# Altium project ESP32WROVER-ARDUPILOT.PrjPcb
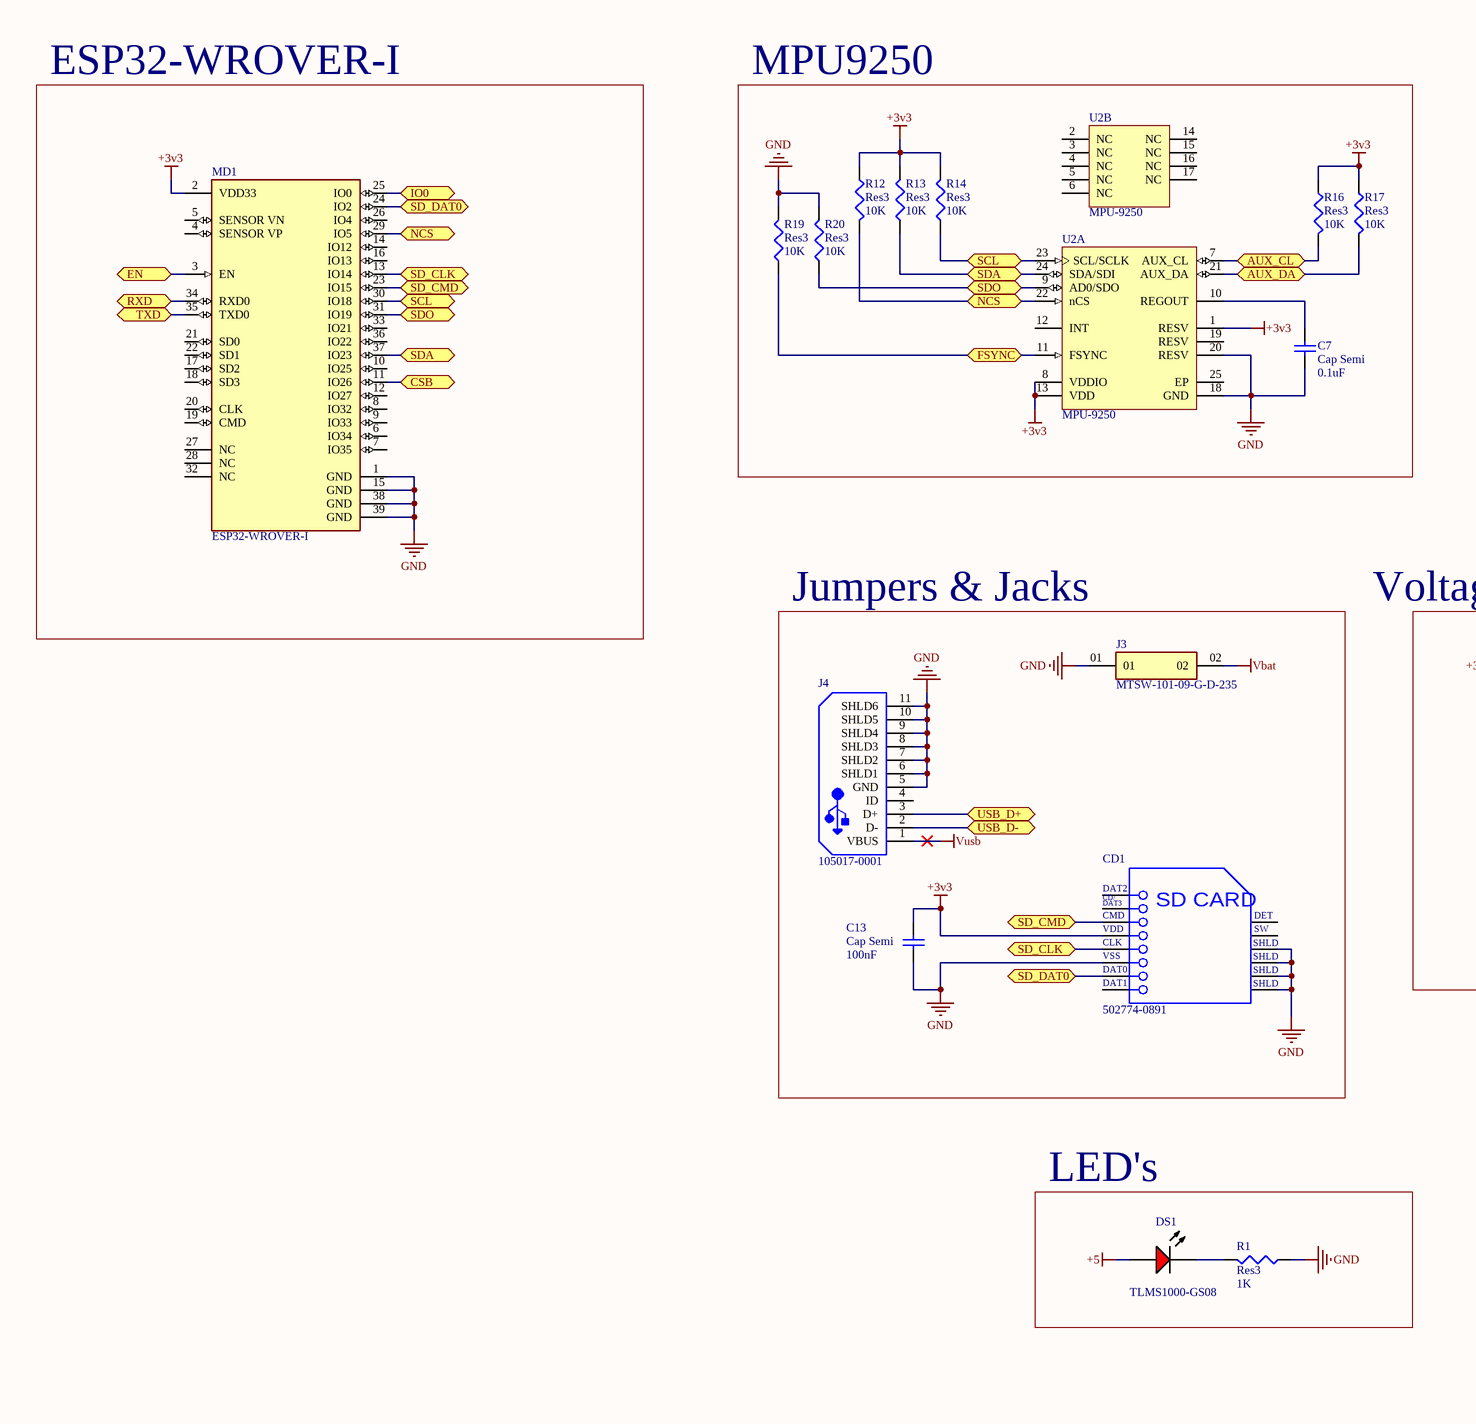
[diagram p0: ESP32WROVER.SchDoc, left]
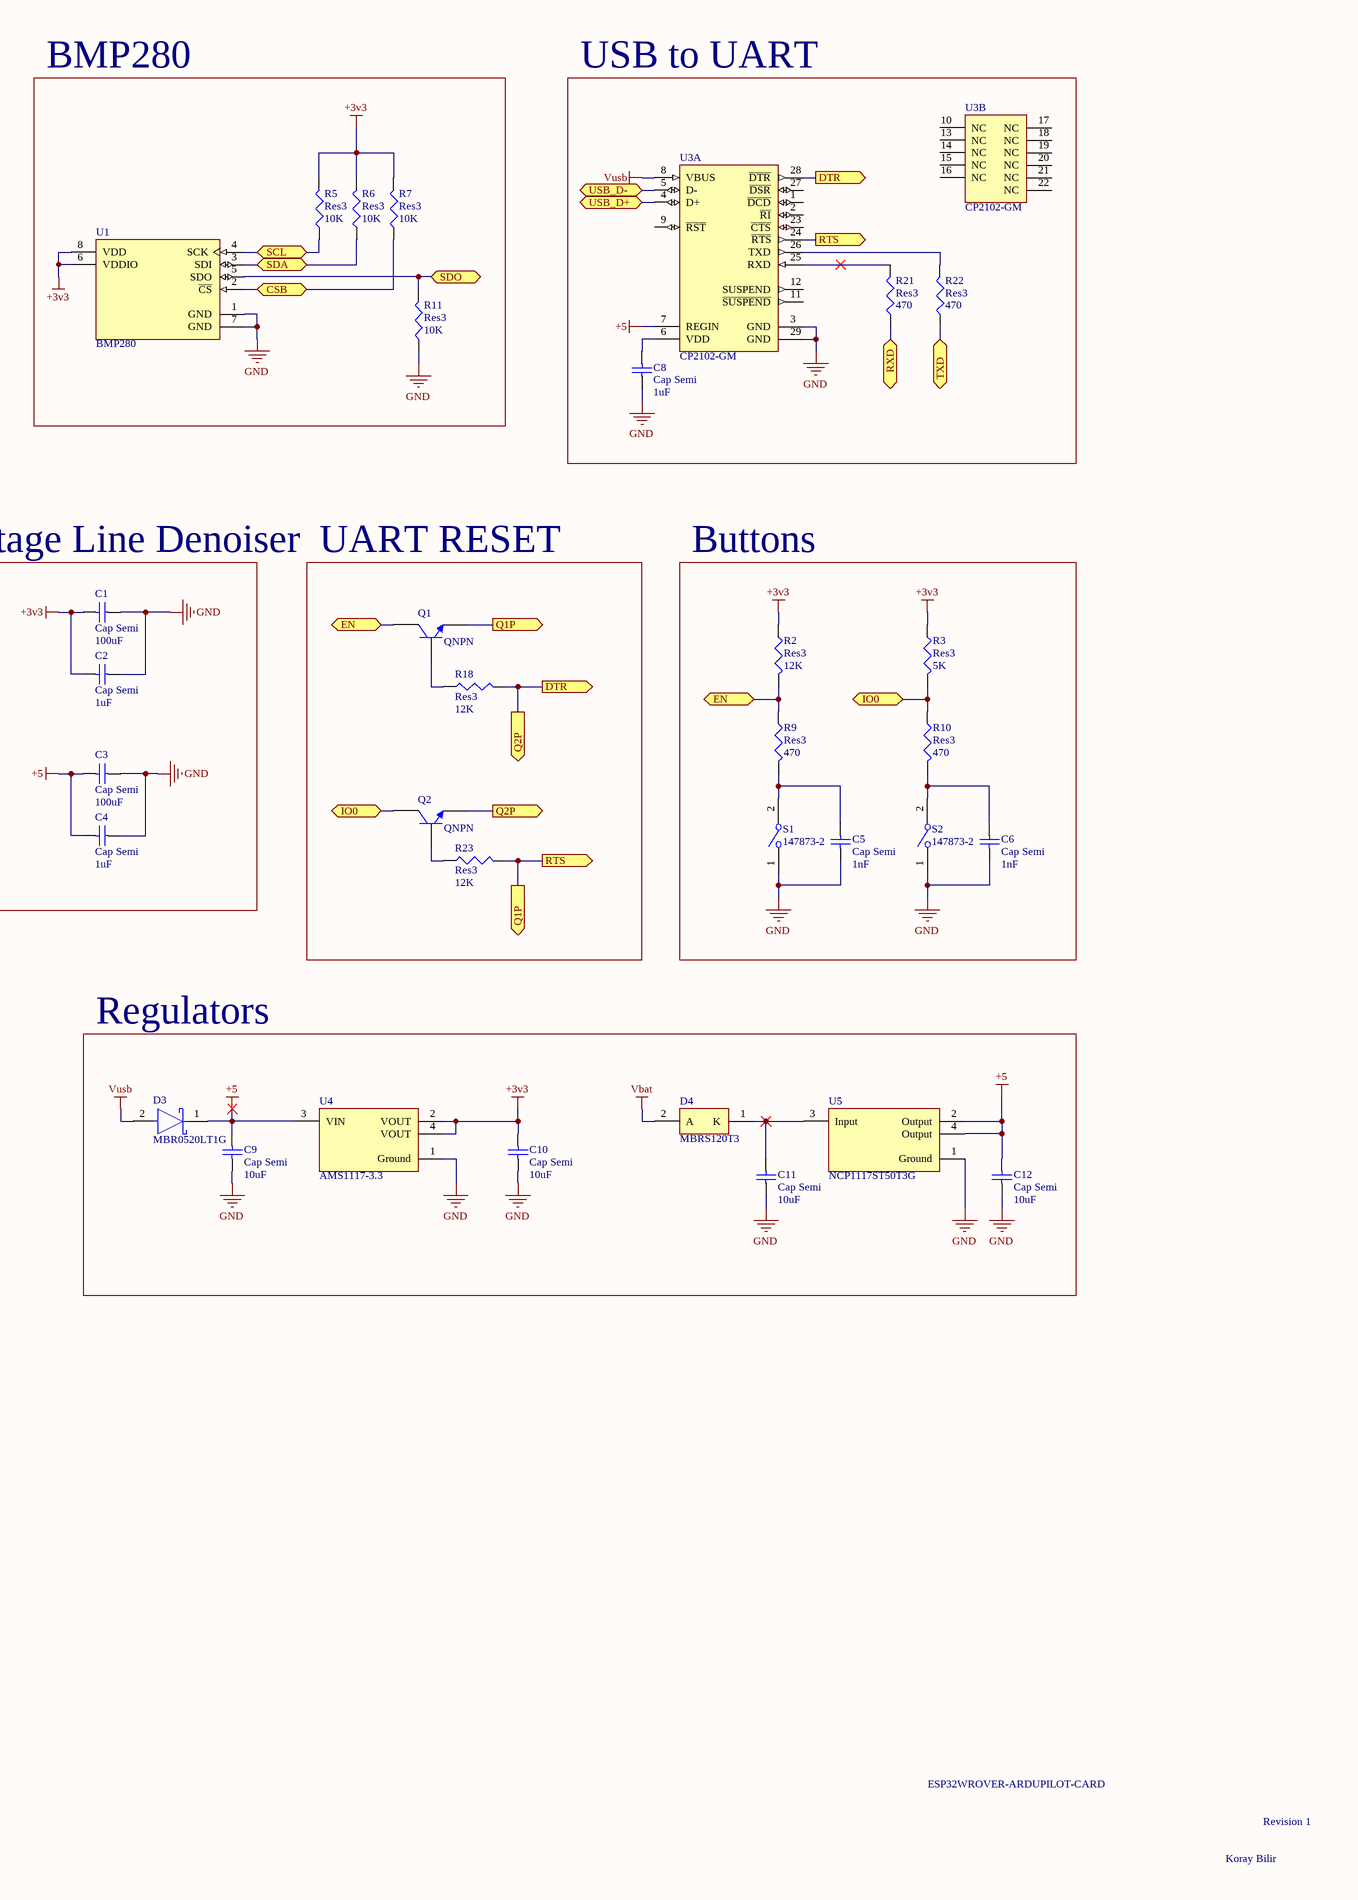
[diagram p1: ESP32WROVER.SchDoc, right]
1 sheet, 49 parts. Net scope: flat (ports and power ports of the same name join across sheets).
Board file: PCB2.PcbDoc

## Sheet ESP32WROVER.SchDoc
size A2

### Parts
C1  Cap Semi  value 100uF  [C1206]
C2  Cap Semi  value 1uF  [C1206]
C3  Cap Semi  value 100uF  [C1206]
C4  Cap Semi  value 1uF  [C1206]
C5  Cap Semi  value 1nF  [C1206]
C6  Cap Semi  value 1nF  [C1206]
C7  Cap Semi  value 0.1uF  [C1206]
C8  Cap Semi  value 1uF  [C1206]
C9  Cap Semi  value 10uF  [C1206]
C10  Cap Semi  value 10uF  [C1206]
C11  Cap Semi  value 10uF  [C1206]
C12  Cap Semi  value 10uF  [C1206]
C13  Cap Semi  value 100nF  [C1206]
CD1  502774-0891  [MOLX-502774-0891_V]
D3  MBR0520LT1G  [FP-425-04-IPC_B]
D4  MBRS120T3  [ONSC-SMB-2-403A-03_H_V]
DS1  TLMS1000-GS08  [VISH-TLMS1000_V]
J3  MTSW-101-09-G-D-235  [SAMTEC_MTSW-101-09-G-D-235]
J4  105017-0001  [USB-MICRO-B_V]
MD1  ESP32-WROVER-I  [FP-ESP32-WROVER-I-MFG]
Q1  QNPN  [SOT-23B_N]
Q2  QNPN  [SOT-23B_N]
R1  Res3  value 1K  [J1-0603]
R2  Res3  value 12K  [J1-0603]
R3  Res3  value 5K  [J1-0603]
R5  Res3  value 10K  [J1-0603]
R6  Res3  value 10K  [J1-0603]
R7  Res3  value 10K  [J1-0603]
R9  Res3  value 470  [J1-0603]
R10  Res3  value 470  [J1-0603]
R11  Res3  value 10K  [J1-0603]
R12  Res3  value 10K  [J1-0603]
R13  Res3  value 10K  [J1-0603]
R14  Res3  value 10K  [J1-0603]
R16  Res3  value 10K  [J1-0603]
R17  Res3  value 10K  [J1-0603]
R18  Res3  value 12K  [J1-0603]
R19  Res3  value 10K  [J1-0603]
R20  Res3  value 10K  [J1-0603]
R21  Res3  value 470  [J1-0603]
R22  Res3  value 470  [J1-0603]
R23  Res3  value 12K  [J1-0603]
S1  147873-2  [SW_147873-2]
S2  147873-2  [SW_147873-2]
U1  BMP280  [FP-BMP280-MFG]
U2  MPU-9250  [INSE-QFN-24-1700X1540TP_M]  (parts A,B of 2)
U3  CP2102-GM  [SLAB-QFN-28-3125x3125TP_N]  (parts A,B of 2)
U4  AMS1117-3.3  [FP-AMS1117-IPC_C]
U5  NCP1117ST50T3G  [FP-318H-MFG]

### Blocks framed on the sheet
ESP32-WROVER-I: MD1
MPU9250: C7 R12-R14 R16 R17 R19 R20 U2
BMP280: R5-R7 R11 U1
USB to UART: C8 R21 R22 U3
Jumpers & Jacks: C13 CD1 J3 J4
UART RESET: Q1 Q2 R18 R23
Buttons: C5 C6 R2 R3 R9 R10 S1 S2
Regulators: C9-C12 D3 D4 U4 U5
LED's: DS1 R1

### Ports
AUX_CL (bidir), AUX_DA (bidir), CSB (bidir), DTR (out), EN (bidir), FSYNC (bidir), IO0 (bidir), NCS (bidir), Q1P (out), Q2P (out), RTS (out), RXD (bidir), SCL (bidir), SD_CLK (bidir), SD_CMD (bidir), SD_DAT0 (bidir), SDA (bidir), SDO (bidir), TXD (bidir), USB_D+ (bidir), USB_D- (bidir)

### Nets
+3v3: C1.2 C2.2 C10.2 C13.1 CD1.4(VDD) MD1.2(VDD33) R2.1 R3.1 R5.2 R6.2 R7.2 R12.1 R13.2 R14.2 R16.1 R17.1 U1.6(VDDIO) U1.8(VDD) U2.1(RESV) U2.8(VDDIO) U2.13(VDD) U4.2(VOUT) U4.4(VOUT)
+5: C3.2 C4.2 C9.2 C12.2 D3.1(C) DS1.1(A) U3.7(REGIN) U4.3(VIN) U5.2(Output) U5.4(Output)
GND: C1.1 C2.1 C3.1 C4.1 C5.1 C6.1 C7.1 C8.1 C9.1 C10.1 C11.1 C12.1 C13.2 CD1.6(VSS) CD1.11(SHLD) CD1.12(SHLD) CD1.13(SHLD) CD1.14(SHLD) J3.01 J4.5(GND) J4.6(SHLD1) J4.7(SHLD2) J4.8(SHLD3) J4.9(SHLD4) J4.10(SHLD5) J4.11(SHLD6) MD1.1(GND) MD1.15(GND) MD1.38(GND) MD1.39(GND) R1.1 R11.1 R19.2 R20.2 S1.1 S2.1 U1.1(GND) U1.7(GND) U2.18(GND) U2.20(RESV) U3.3(GND) U3.29(GND) U4.1(Ground) U5.1(Ground)
Vbat: D4.2(A) J3.02
Vusb: D3.2(A) J4.1(VBUS) U3.8(VBUS)
NetC5_2: C5.2 R9.2 S1.2
NetC6_2: C6.2 R10.2 S2.2
NetC7_2: C7.2 U2.10(REGOUT)
NetC8_2: C8.2 U3.6(VDD)
NetC11_2: C11.2 D4.1(K) U5.3(Input)
NetCD1_3: CD1.3(CMD) MD1.23(IO15) ; port SD_CMD
NetCD1_5: CD1.5(CLK) MD1.13(IO14) ; port SD_CLK
NetCD1_7: CD1.7(DAT0) MD1.24(IO2) ; port SD_DAT0
NetDS1_2: DS1.2(K) R1.2
NetJ4_2: J4.2(D-) U3.5(D-) ; port USB_D-
NetJ4_3: J4.3(D+) U3.4(D+) ; port USB_D+
NetMD1_3: MD1.3(EN) Q1.1(C) R2.2 R9.1 ; port EN
NetMD1_11: MD1.11(IO26) R7.1 U1.2(~{CS}) ; port CSB
NetMD1_25: MD1.25(IO0) Q2.1(C) R3.2 R10.1 ; port IO0
NetMD1_29: MD1.29(IO5) R12.2 U2.22(nCS) ; port NCS
NetMD1_30: MD1.30(IO18) R5.1 R14.1 U1.4(SCK) U2.23(SCL/SCLK) ; port SCL
NetMD1_31: MD1.31(IO19) R11.2 R20.1 U1.5(SDO) U2.9(AD0/SDO) ; port SDO
NetMD1_34: MD1.34(RXD0) R21.1 ; port RXD
NetMD1_35: MD1.35(TXD0) R22.1 ; port TXD
NetMD1_37: MD1.37(IO23) R6.1 R13.1 U1.3(SDI) U2.24(SDA/SDI) ; port SDA
NetQ1_2: Q1.2(B) R18.1
NetQ1_3: Q1.3(E) R23.2 U3.24(~{RTS}) ; port RTS, port Q1P
NetQ2_2: Q2.2(B) R23.1
NetQ2_3: Q2.3(E) R18.2 U3.28(~{DTR}) ; port DTR, port Q2P
NetR16_2: R16.2 U2.7(AUX_CL) ; port AUX_CL
NetR17_2: R17.2 U2.21(AUX_DA) ; port AUX_DA
NetR19_1: R19.1 U2.11(FSYNC) ; port FSYNC
NetR21_2: R21.2 U3.25(RXD)
NetR22_2: R22.2 U3.26(TXD)

Not connected (* = marked no-connect by the designer): CD1 1(DAT2) 2(CD/DAT3) 8(DAT1) 9(DETECT) 10(SWITCH); J4 4(ID); MD1 4(SENSOR_VP) 5(SENSOR_VN) 6(IO34) 7(IO35) 8(IO32) 9(IO33) 10(IO25) 12(IO27) 14(IO12) 16(IO13) 17(SD2) 18(SD3) 19(CMD) 20(CLK) 21(SD0) 22(SD1) 26(IO4) 27(NC) 28(NC) 32(NC) 33(IO21) 36(IO22); U2 2(NC) 3(NC) 4(NC) 5(NC) 6(NC) 12(INT) 14(NC) 15(NC) 16(NC) 17(NC) 19(RESV) 25(EP); U3 1(~{DCD}) 2(~{RI}) 9(~{RST}) 10(NC) 11(~{SUSPEND}) 12(SUSPEND) 13(NC) 14(NC) 15(NC) 16(NC) 17(NC) 18(NC) 19(NC) 20(NC) 21(NC) 22(NC) 23(~{CTS}) 27(~{DSR})

### Notes on the sheet
- Voltage Line Denoiser
- ESP32WROVER-ARDUPILOT-CARD
- Koray Bilir
- Revision 1
- (in symbol CMP-2000-05248-1) CD/; DAT3; SD CARD; DET; SW

### Library data of the parts
C1-C13 = Cap Semi: Capacitor (Semiconductor SIM Model); Published: 8-Jun-2000; LatestRevisionDate: 29-May-2009; LatestRevisionNote: IPC-7351 Footprint Added.; PackageReference: C1206; Publisher: Altium Limited; PackageDescription: Chip Capacitor
CD1 = CMP-2000-05248-1: Micro SD Memory Card Connector, 0.5 A, 10 V (DC), -25 to 85 degC, 8-Pin SMT, RoHS, Tape and Reel; Manufacturer: Molex; 3D Model: 502774-0891.stp; Online Catalog: microSD™Series; Number of Positions: 10(8+2); Card Type: SecureDigital-microSD™; Insertion, Removal Method: PushIn,PushOut; Other Names: WM24066DKR; Connector Type: ConnectorandEjector; Features: Switch; Family: MemoryConnectors-PCCardSockets; Manufacturer URL: http://www.molex.com/; Mounting Type: SurfaceMount,RightAngle; Contact Finish Thickness: 20µin(0.51µm); Standard Package: 1; Series: 502774; Ejector Side: -; Datasheet Version: Rev. D, 04/2004; Category: Connectors,Interconnects; Contact Finish: Gold; Datasheet URL: https://datasheet.ciiva.com/1104/1499551-1104671.pdf; RoHS Information: 502774-0891CertofCompliance; Mounting Feature: Reverse-Bottom; Packaging: Digi-Reel; Height Above Board: 0.071"(1.80mm); Catalog Drawings: 502774-0891
D3 = CMP-1055-00425-2: DIODE SCHOTTKY 20V 500MA SOD123; Polarity: Standard; Peak Non-Repetitive Surge Current: 5.5A; Forward Voltage: 385mV; Element Configuration: Single; Peak Reverse Current: 250uA; Max Repetitive Reverse Voltage (Vrrm): 20V; Voltage Rating (DC): 20V; Case/Package: SOD-123-2; Number of Pins: 2; Output Current: 500mA; Min Operating Temperature: -65°C; Lead Free: Lead Free; REACH SVHC: No SVHC; Max Reverse Voltage (DC): 20V; Termination: SMD/SMT; Average Rectified Current: 500mA; Max Surge Current: 5.5A; Package Quantity: 3000; Height: 1.12mm; Current Rating: 500mA; Forward Current: 500mA; Max Forward Surge Current (Ifsm): 5.5A; Packaging: Tape and Reel; Length: 2.69mm; Radiation Hardening: No; Max Reverse Leakage Current: 250uA; Width: 1.6mm; Contact Plating: Tin; Max Operating Temperature: 125°C
D4 = CMP-1055-00352-1: Schottky Power Rectifier, 2-Pin SMB, Tape and Reel; Manufacturer: On Semiconductor; IFSM Max (A): 40; Configuration: Single; ComponentLink3Description: Package Specification; ComponentLink2URL: http://www.onsemi.cn/pub_link/Collateral/MBRS120T3-D.PDF; ComponentLink1Description: Manufacturer URL; Mounting Technology: Surface Mount; PackageReference: SMB-2-403A-03_H; PartNumber: MBRS120T3; Packing: Tape and Reel; RoHS: FALSE; ComponentLink3URL: http://www.onsemi.com/pub_link/Collateral/1SMB5913BT3-D.PDF; DatasheetVersion: Rev. 7; ComponentLink2Description: Datasheet; ComponentLink1URL: http://www.onsemi.com/; PackageVersion: Rev. H, 05/2011; PackageDescription: 2-Pin Small Molded Package, J-Bend Lead, Body 4.33 x 3.625 mm
DS1 = CMP-2000-07254-1: Low Current LED, 40 mW, 1.8 V, -40 to 100 degC, 2-Pin SMD (0603), RoHS, Tape and Reel; Manufacturer: Vishay; Lens Shape: Rectangular; Automotive Qualification Standard: AEC-Q100; Wavelength Typ: 636nm; SVHC: ToBeAdvised; LED Colour: Red; Bulb Size: 1.6mmx0.8mm; Forward Voltage: 1.8V; Luminous Intensity: 4mcd; Forward Current If: 2mA; Viewing Angle: 80°; Datasheet Version: Rev. 1.7, 02/2011; Datasheet URL: https://datasheet.ciiva.com/5798/1698881-5798337.pdf; LED Mounting: SMD; Packaging: CutTape; Package Reference: TLMS1000; Manufacturer URL: http://www.vishay.com/; Mounting Technology: SurfaceMount; Product Range: -; Package Description: 2-Pin Surface Mount Device, Body 1.6 x 0.8 mm; MSL: MSL2-1year
J3 = MTSW-101-09-G-D-235: MF: {'manufacturer': u'Samtec'}; Price: None; Value: *; MP: MTSW-101-09-G-D-235; Availability: Unavailable; Package: None
J4 = CMP-2000-05827-1: Micro-USB B Receptacle, Right Angle, Bottom Mount, Surface Mount, with Solder Tabs, -30 to 85 degC, 5-Pin USB, RoHS, Tape and Reel; Manufacturer: Molex; Featured Product: Micro-USBConnectorsUSBConnectors; Other Names: WM1399DKR; Package Version: Rev. F, 12/2012; Number of Contacts: 5; Connector Type: USB-microB; Catalog Drawings: 1050170001; 3D Model: 105017-0001.stp; Mating Products: WM17145-ND-CABLEMICROUSBBTOSTDA1.0MWM17147-ND-CABLEMICROUSBBTOSTDA2.0MWM17146-ND-CABLEMICROUSBBTOSTDA1.5M; PCN Assembly/Origin: ResinSupplier21/Oct/2015; Voltage - Max: 30V; Online Catalog: Molex-MicroUSB; Manufacturer URL: http://www.molex.com/; Package Description: 5-Leads USB, Micro B, Body 7.5 x 5 mm, Pitch 0.65 mm; Datasheet URL: http://www.molex.com/elqNow/elqRedir.htm?ref=http://www.molex.com/webdocs/datasheets/pdf/en-us/1050170001_IO_CONNECTORS.pdf; Ingress Protection: -; Datasheet Version: 03/2016; Mounting Type: BoardCutout,SurfaceMount,RightAngle; Circuits: 5; Standard Package: 1; Package Reference: MICRO-B; Package URL: http://www.molex.com/pdm_docs/sd/1050170001_sd.pdf; Category: Connectors,Interconnects; Series: -; RoHS Information: 1050170001CertofCompliance; Features: Shielded,SolderRetention; Family: USB,DVI,HDMIConnectors; Specifications: -; Gender: Receptacle; Packaging: Digi-Reel®; Mounting Technology: SurfaceMount
MD1 = CMP-194065-000001-1: SMD MODULE, ESP32-D0WDQ6, 32MBIT; Manufacturer: Espressif; Number Of Adc Channels: 16; Min Supply Voltage: 2.3V; Interface: I2C,SPI,UART,I2S,Other; Max Frequency: 2484MHz; Nominal Supply Current: 500mA; Sensitivity: -98dBm; Max Supply Voltage: 3.6V; Number Of Gpio: 20; Data Rate: 150Mbits/s; Package: ESP32-WROVER-I; Temperature Range Low: -40°C; Temperature Range High: +85°C; Device Class L1: Integrated Circuits (ICs); Category: UNK; ComponentLink2Description: Datasheet; Device Class L2: RF Semiconductors and Devices; Automotive: No; Lead Free: Yes; Octopart: https://octopart.com/esp32-wrover-i-espressif+systems-89171349; ComponentLink2URL: https://www.espressif.com/sites/default/files/documentation/esp32-wrover_datasheet_en.pdf; Temperature: -40°C to +85°C; Height: 3.4mm; RoHS: TRUE; Digikey Description: SMD MODULE, ESP32-D0WDQ6, 32MBIT; Device Class L3: Transceivers; Manufacturer Part Number: ESP32-WROVER-I
Q1 Q2 = QNPN: NPN Bipolar Transistor; Published: 8-Jun-2000; LatestRevisionDate: 29-May-2009; LatestRevisionNote: IPC-7351 Footprint Added.; PackageVersion: Aug-1999; PackageReference: SOT-23B; Publisher: Altium Limited; PackageDescription: 3-Pin SOT-23 Package 0.95 mm Pitch, 2.4 mm Lead Span
R1-R3 R5-R7 R9-R14 R16-R23 = Res3: Resistor; Published: 8-Jun-2000; LatestRevisionDate: 29-May-2009; LatestRevisionNote: IPC-7351 Footprint Added.; PackageReference: J1-0603; Publisher: Altium Limited; PackageDescription: Chip Resistor
S1 S2 = 147873-2: SWITCH TACTILE SPST-NO 0.05A 24V; MF: {'manufacturer': u'TE Connectivity'}; Price: None; Value: *; MP: 147873-2; Availability: Unavailable; Package: None
U1 = CMP-2000-05076-3: SENSOR PRESSURE ABS; Operating Pressure: 15.95PSI; Pressure Type: Absolute; Output Type: SPI; Max Pressure: 290.08PSI; Port Style: No Port; Case/Package: SMD/SMT; Lead Free: Lead Free; Termination: SMD/SMT; Min Operating Temperature: -40°C; Number of Pins: 8; Max Operating Temperature: 85°C
U2 = CMP-2100-03657-1: 9-axis MotionTracking device, 2.4 to 3,6 V, -40 to 85 degC, 24-Pin QFN, RoHS, Tape and Reel; Manufacturer: InvenSense; Max Supply Voltage: 3.6V; Min Supply Voltage: 2.4V; Package Reference: QFN-24; Package Quantity: 1; Datasheet Version: Rev. 1.0, 01/2014; Case/Package: QFN; Package Description: 24-Pin Quad Flat No-lead Package, Body 3 x 3 mm, Pitch 0.4 mm; Datasheet URL: http://datasheet.octopart.com/MPU-9250-InvenSense-datasheet-21859386.pdf; RoHSCompliant: true; Max Operating Temperature: 85degC; Height: 1mm; Mount: SurfaceMount; Manufacturer URL: http://www.invensense.com/; Width: 3.1mm; Min Operating Temperature: -40degC; Length: 3.1mm
U3 = CMP-0511-00012-1: Single-Chip USB to UART Bridge, 1024 Bytes EEPROM, -40 to 85 degC, 28-pin QFN, Tube; Manufacturer: Silicon Labs; Internal Oscillator: TRUE; Sub-Family: USB Bridges; ComponentLink3Description: Package Specification; PackageDescription: 28-Pin Quad-Flat No-Leads Package, Body 5 x 5 mm, Pitch 0.5 mm; PartNumber: CP2102-GM; EEPROM: 1024 Bytes; Mounting Technology: Surface Mount; ComponentLink2URL: http://www.silabs.com/Support%20Documents/TechnicalDocs/CP2102-9.pdf; DatasheetVersion: Rev. 1.5; ComponentLink1URL: http://www.silabs.com/; ComponentLink2Description: Datasheet; Code_JEDEC: MO-220; PackageReference: QFN-28; Code_IPC: J-STD-020C; ComponentLink3URL: http://www.silabs.com/Support%20Documents/TechnicalDocs/C8051T61x.pdf; ComponentLink1Description: Manufacturer URL
U4 = CMP-209535-000001-1: LDO Voltage Regulators 1A, 3.3V; Manufacturer: Advanced Monolithic Systems; Dropout Voltage: 1.1V; Output Type: Fixed; Nominal Supply Current: 5mA; Max Power Dissipation: 1.2W; Max Supply Voltage: 15V; Number Of Outputs: 1; Standoff Height: 0.64mm; Max Junction Temp: +125°C; Height: 1.8mm; Package: AMS1117; Device Class L2: Power Management ICs; ComponentLink2Description: Datasheet; ComponentLink2URL: http://www.advanced-monolithic.com/pdf/ds1117.pdf; Category: IC; RoHS: TRUE; Automotive: No; Device Class L1: Integrated Circuits (ICs); Output Current: 1A; Device Class L3: Voltage Regulators - Linear; Temperature: -40°C to +125°C; Output Voltage: 3.3V; Manufacturer Part Number: AMS1117-3.3; Temperature Range Low: -40°C; Octopart: https://octopart.com/ams1117-3.3-advanced+monolithic+systems-25899300; Lead Free: Yes; Ipc Land Pattern Name: SOT229P700X180-4; Temperature Range High: +125°C
U5 = CMP-0592-00001-4: IC REG LINEAR 5V 1A SOT223; Output Voltage Accuracy: 1%; Number of Outputs: 1; Dropout Voltage: 1.2V; Polarity: Positive; Power Rating: 781mW; Input Bias Current: 6mA; Quiescent Current: 10mA; Output Type: Fixed; Max Input Voltage: 20V; Min Input Voltage: 3.5V; Max Operating Temperature: 125°C; Number of Pins: 4; Case/Package: SOT-223; Min Operating Temperature: 0°C; Accuracy: 1%; Contact Plating: Tin; Min Current Limit: 1A; Output Current: 1A; Max Output Current: 1A; Length: 6.7mm; Packaging: Tape and Reel; Package Quantity: 1; Height: 1.69mm; REACH SVHC: No SVHC; Width: 3.7mm; Halogen Free: Halogen Free; RoHS Compliant: Yes; Nominal Output Voltage: 5V; Lead Free: Lead Free; Radiation Hardening: No; Tolerance: 1%; Number of Regulators: 1; Output Voltage: 5V